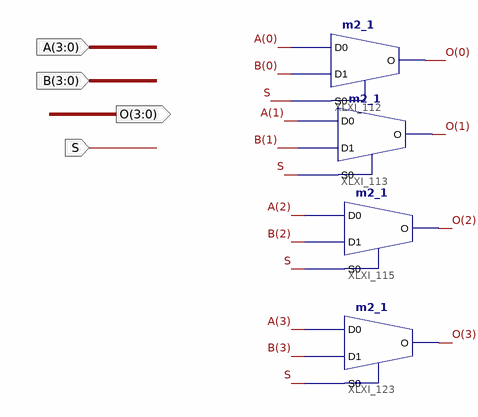
[diagram p0: schematic sheet 1]
// Xilinx ISE schematic mux4b2.sch (artix7) as structural Verilog: 4 symbols, 4 ports
module mux4b2 (
  input  [3:0] A,
  input  [3:0] B,
  input  S,
  output [3:0] O
);

  m2_1 XLXI_112 (.D0(A[0]), .D1(B[0]), .S0(S), .O(O[0]));
  m2_1 XLXI_113 (.D0(A[1]), .D1(B[1]), .S0(S), .O(O[1]));
  m2_1 XLXI_115 (.D0(A[2]), .D1(B[2]), .S0(S), .O(O[2]));
  m2_1 XLXI_123 (.D0(A[3]), .D1(B[3]), .S0(S), .O(O[3]));
endmodule
